# Altium schematic sheet PowerBoard_SystemDiagram.SchDoc
size A; SheetNumber: 2; SheetTotal: 4
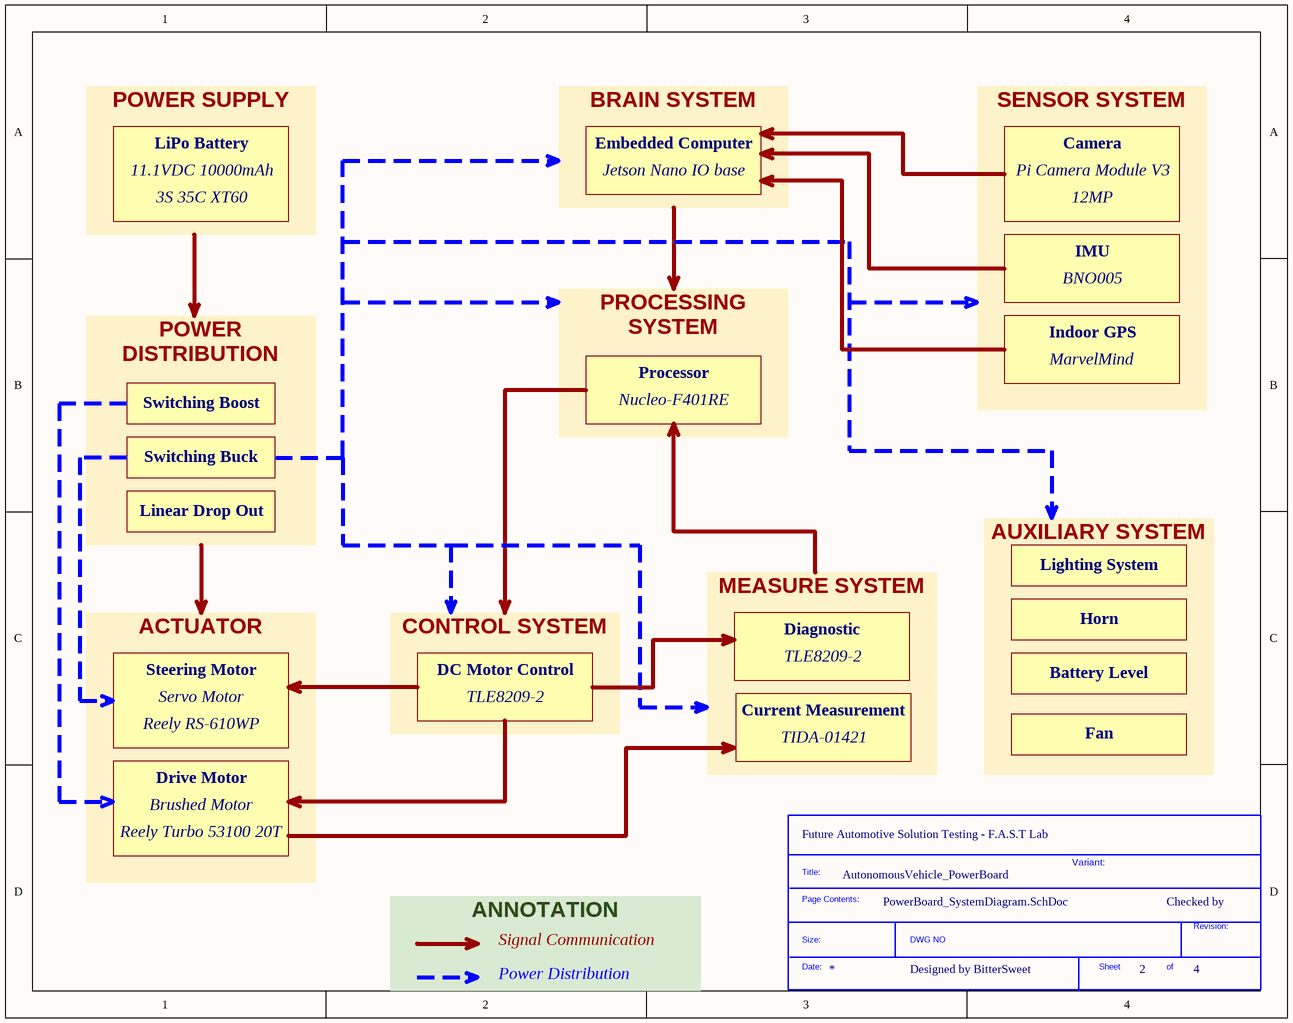
[diagram p0: PowerBoard_SystemDiagram.SchDoc]

## Parts
*?  SDTitleBlock  (value not drawn)  (graphical)

## Notes on the sheet
- LiPo Battery
- Embedded Computer
- Camera
- POWER SUPPLY
- 11.1VDC 10000mAh
- 3S 35C XT60
- BRAIN SYSTEM
- Jetson Nano IO base
- Pi Camera Module V3
- 12MP
- BNO005
- IMU
- Indoor GPS
- MarvelMind
- Switching Boost
- PROCESSING SYSTEM
- Nucleo-F401RE
- Processor
- SENSOR SYSTEM
- Switching Buck
- POWER DISTRIBUTION
- Linear Drop Out
- Lighting System
- Diagnostic
- Horn
- Steering Motor
- Servo Motor
- DC Motor Control
- TLE8209-2
- Battery Level
- Reely RS-610WP
- CONTROL SYSTEM
- (near *?) MEASURE SYSTEM
- Current Measurement
- TIDA-01421
- AUXILIARY SYSTEM
- Fan
- Reely Turbo 53100 20T
- Brushed Motor
- Drive Motor
- (near *?) Future Automotive Solution Testing - F.A.S.T Lab
- ACTUATOR
- AutonomousVehicle_PowerBoard
- Variant:
- Checked by
- Signal Communication
- Designed by BitterSweet
- ANNOTATION
- Power Distribution
- (in symbol SDTitleBlock) Title:; Page Contents:; Revision:; Size:; DWG NO; Date:; Sheet; of